# EAGLE design openSipPuff (rev B) (EAGLE 6.4)
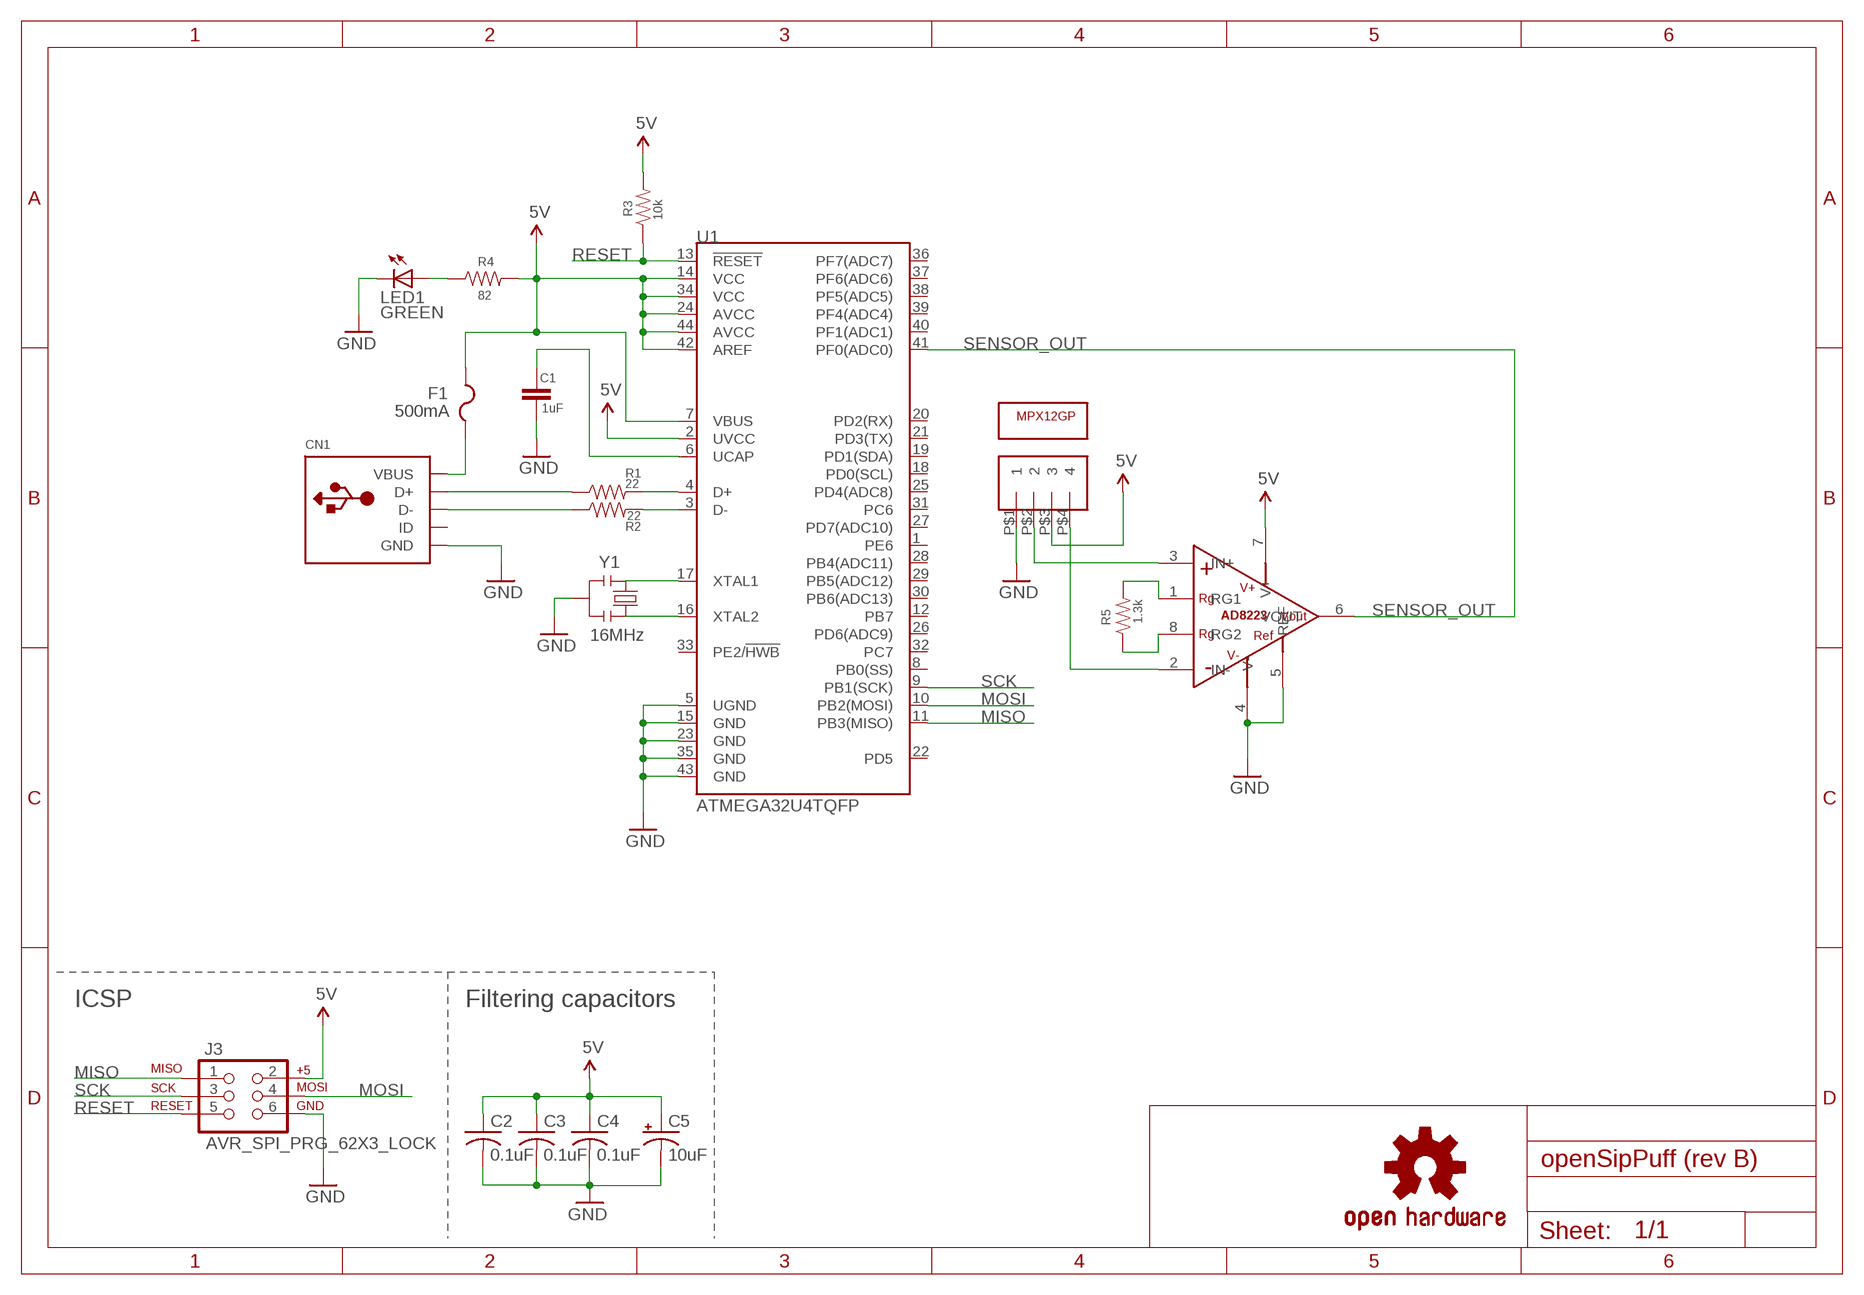
[diagram p0: schematic, sheet 1]

## Parts
C1  1uF  CAP0805  [0805]
C2  0.1uF  C-USC0805K  [C0805K]
C3  0.1uF  C-USC0805K  [C0805K]
C4  0.1uF  C-USC0805K  [C0805K]
C5  10uF  CPOL-USA/3216-18R  [A/3216-18R]
CN1  USBMOLEX  [USB-MINIB-THM-MOLEX]
F1  500mA  PTCFUSE-1206  [R1206]
J2  1X04-RA  [1X04-RA]
J3  AVR_SPI_PRG_62X3_LOCK  [2X3_LOCK]
LED1  GREEN  LEDCHIPLED_0805  [CHIPLED_0805]
LOGO1  OSHW-LOGOM  [OSHW-LOGO-M]
R1  22  RESISTOR0805-RES  [0805]
R2  22  RESISTOR0805-RES  [0805]
R3  10k  RESISTOR0805-RES  [0805]
R4  82  RESISTOR0805-RES  [0805]
R5  1.3k  RESISTOR0805-RES  [0805]
U1  ATMEGA32U4TQFP  [SPARKFUN-DIGITALIC_TQFP44]
U2  AD8223  [MSOP-8]
U3  MPX12GP  [MPX12GP]
Y1  16MHz  RESONATORPTH  [RESONATOR-PTH]

## Nets
5V: C2.1 C3.1 C4.1 C5.+ F1.2 J2.P$3 J3.2 R3.2 R4.2 U1.2(UVCC) U1.7(VBUS) U1.14(VCC) U1.24(AVCC) U1.34(VCC) U1.42(AREF) U1.44(AVCC) U2.7(V+)
D+: CN1.D+ R1.1
D-: CN1.D- R2.1
GND: C1.2 C2.2 C3.2 C4.2 C5.- CN1.GND J2.P$1 J3.6 LED1.C U1.5(UGND) U1.15(GND) U1.23(GND) U1.35(GND) U1.43(GND) U2.4(V-) U2.5(REF) Y1.2
MISO: J3.1 U1.11(PB3(MISO))
MOSI: J3.4 U1.10(PB2(MOSI))
N$1: R1.2 U1.4(D+)
N$2: R2.2 U1.3(D-)
N$3: C1.1 U1.6(UCAP)
N$4: CN1.VBUS F1.1
N$5: U1.17(XTAL1) Y1.1
N$6: U1.16(XTAL2) Y1.3
N$7: R5.2 U2.1(RG1)
N$10: J2.P$2 U2.3(IN+)
N$11: R5.1 U2.8(RG2)
N$12: LED1.A R4.1
N$13: J2.P$4 U2.2(IN-)
RESET: J3.5 R3.1 U1.13(!RESET)
SCK: J3.3 U1.9(PB1(SCK))
SENSOR_OUT: U1.41(PF0(ADC0)) U2.6(VOUT)
Unconnected: CN1.ID U1.1(PE6) U1.8(PB0(SS)) U1.12(PB7) U1.18(PD0(SCL)) U1.19(PD1(SDA)) U1.20(PD2(RX)) U1.21(PD3(TX)) U1.22(PD5) U1.25(PD4(ADC8)) U1.26(PD6(ADC9)) U1.27(PD7(ADC10)) U1.28(PB4(ADC11)) U1.29(PB5(ADC12)) U1.30(PB6(ADC13)) U1.31(PC6) U1.32(PC7) U1.33(PE2/!HWB) U1.36(PF7(ADC7)) U1.37(PF6(ADC6)) U1.38(PF5(ADC5)) U1.39(PF4(ADC4)) U1.40(PF1(ADC1))

## Notes on the sheet
- ICSP | Filtering capacitors

## Library data of the parts
C1 = SparkFun-Capacitors:CAP: Capacitor Standard 0603 ceramic capacitor, and 0.1" leaded capacitor.
C2-C4 = adafruit:C-US: CAPACITOR, American symbol
C5 = adafruit:CPOL-US: POLARIZED CAPACITOR, American symbol
CN1 = adafruit:USB: USB Connectors USBMINIB - Surface Mount Female Mini-B USB Connector 4UConnector: 06564 By microbuilder.eu Thru-hole RA Female Mini-B USB Connector 4UConnector: 18732 By ladyada.net
F1 = adafruit:PTCFUSE: PTC fuses, resettable thermistors
J2 = sip-and-puff:1X04-RA
J3 = SparkFun-Connectors:AVR_SPI_PRG_6: AVR ISP 6 Pin This is the reduced ISP connector for AVR programming. Common on Arduino. This footprint will take up less PCB space and can be used with a 10-pin to 6-pin adapter such as SKU: BOB-08508
LED1 = led:LED: LED OSRAM: - CHIPLED LG R971, LG N971, LY N971, LG Q971, LY Q971, LO R971, LY R971 LH N974, LH R974 LS Q976, LO Q976, LY Q976 LO Q996 - Hyper CHIPLED LW Q18S LB Q993, LB Q99A, LB R99A - SideLED LS A670, LO A670, LY A670, LG A670, LP A670 LB A673, LV A673, LT A673, LW A673 LH A674 LY A675 LS A676, LA A676, LO A676, LY A676, LW A676 LS A679, LY A679, LG A679 - Hyper Micro SIDELED® LS Y876, LA Y876, LO Y876, LY Y876 LT Y87S - SmartLED LW L88C, LW L88S LB L89C, LB L89S, LG L890 LS L89K, LO L89K, LY L89K LS L896, LA L896, LO L896, LY L896 - TOPLED LS T670, LO T670, LY T670, LG T670, LP T670 LSG T670, LSP T670, LSY T670, LOP T670, LYG T670 LG T671, LOG T671, LSG T671 LB T673, LV T673, LT T673, LW T673 LH T674 LS T676, LA T676, LO T676, LY T676, LB T676, LH T676, LSB T676, LW T676 LB T67C, LV T67C, LT T67C, LS T67K, LO T67K, LY T67K, LW E67C LS E67B, LA E67B, LO E67B, LY E67B, LB E67C, LV E67C, LT E67C LW T67C LS T679, LY T679, LG T679 LS T770, LO T770, LY T770, LG T770, LP T770 LB T773, LV T773, LT T773, LW T773 LH T774 LS E675, LA E675, LY E675, LS T675 LS T776, LA T776, LO T776, LY T776, LB T776 LHGB T686 LT T68C, LB T68C - Hyper Mini TOPLED® LB M676 - Mini TOPLED Santana® LG M470 LS M47K, LO M47K, LY M47K Source: http://www.osram.convergy.de LUXEON: - LUMILED® LXK2-PW12-R00, LXK2-PW12-S00, LXK2-PW14-U00, LXK2-PW14-V00 LXK2-PM12-R00, LXK2-PM12-S00, LXK2-PM14-U00 LXK2-PE12-Q00, LXK2-PE12-R00, LXK2-PE12-S00, LXK2-PE14-T00, LXK2-PE14-U00 LXK2-PB12-K00, LXK2-PB12-L00, LXK2-PB12-M00, LXK2-PB14-N00, LXK2-PB14-P00, LXK2-PB14-Q00 LXK2-PR12-L00, LXK2-PR12-M00, LXK2-PR14-Q00, LXK2-PR14-R00 LXK2-PD12-Q00, LXK2-PD12-R00, LXK2-PD12-S00 LXK2-PH12-R00, LXK2-PH12-S00 LXK2-PL12-P00, LXK2-PL12-Q00, LXK2-PL12-R00 Source: www.luxeon.com KINGBRIGHT: KA-3528ASYC Source: www.kingbright.com
LOGO1 = SparkFun-Aesthetics:OSHW-LOGO: Open Source Hardware Logo This logo indicates the piece of hardware it is found on incorporates a OSHW license and/or adheres to the definition of open source hardware found here: http://freedomdefined.org/OSHW
R1-R5 = SparkFun-Resistors:RESISTOR: Resistor Basic schematic elements and footprints for 0603, 1206, and PTH resistors.
U1 = SparkFun-DigitalIC:ATMEGA32U4: Atmel 44-pin 8-bit Microcontroller with 32KBytes of ISP Flash and USB Controller
U2 = sip-and-puff:AD8223
U3 = sip-and-puff:MPX12GP
Y1 = SparkFun-FreqCtrl:RESONATOR: Resonator Small SMD resonator. Used, eg, on the Arduino Pro/ Pro Mini boards. 8MHz- XTAL-08895 16MHz- XTAL-08900

## Board
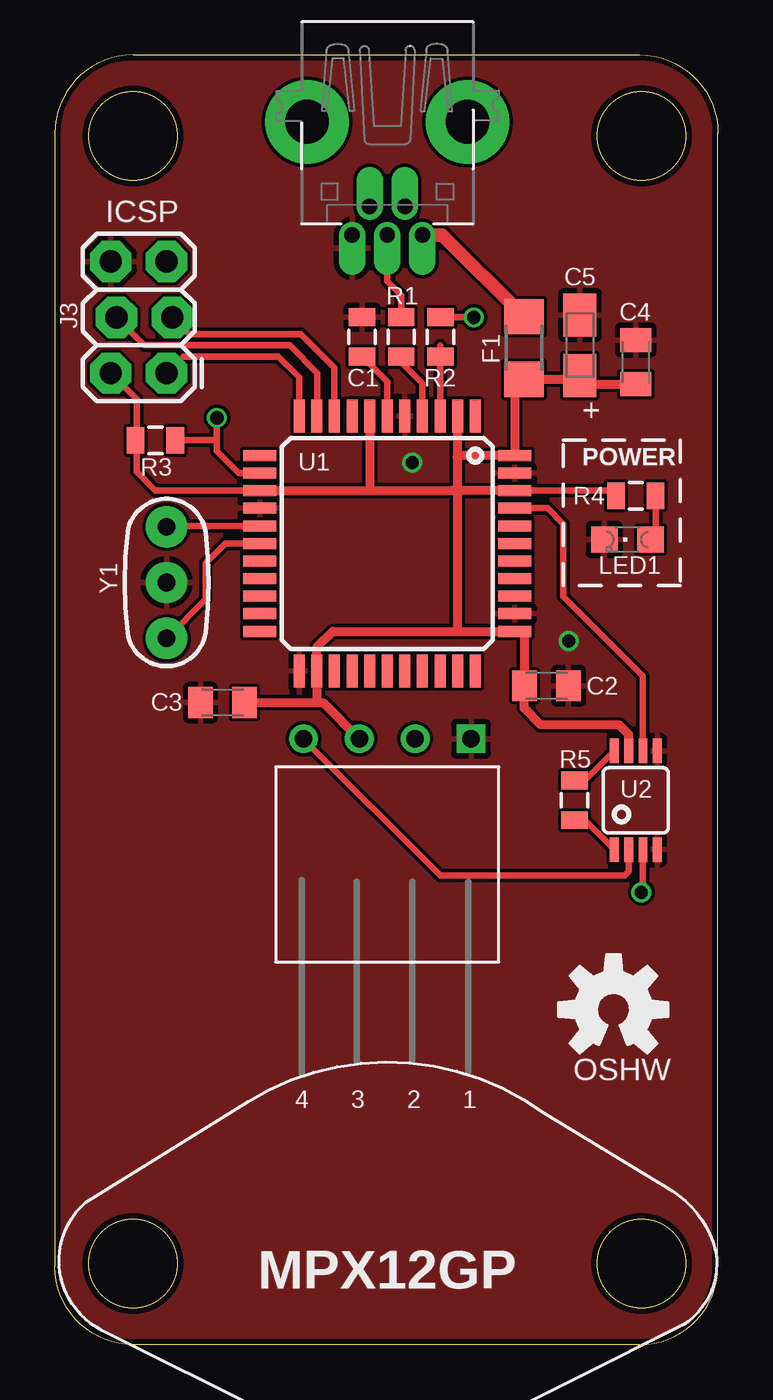
[diagram p1: board, top side]
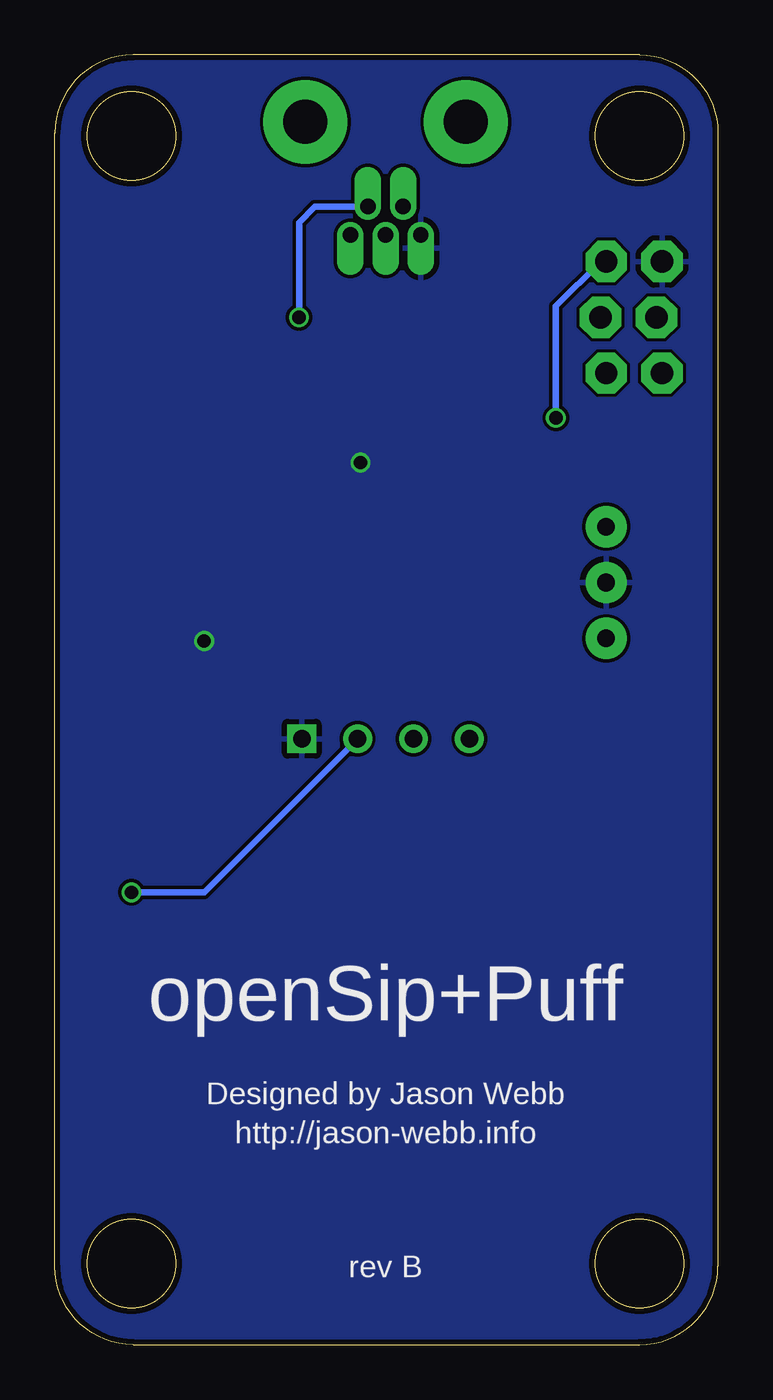
[diagram p2: board, bottom side, seen from below]

Size 30.15 x 58.67 mm. Coordinates in mm from the lower left corner, seen from the top.
Outline: 30.15,3.56 30.15,55.12 arc90 26.59,58.67 3.56,58.67 arc90 0,55.12 0,3.56 arc90 3.56,0 26.59,0 arc90 30.15,3.56
Outline: circle at 3.56,54.99 radius 2.02
Outline: circle at 26.67,54.99 radius 2.02
Copper layers (1*16): Top 0.035mm / dielectric 1.5mm / Bottom 0.035mm
Design rules "Fusion_eagle_rule_v1.1": minimum track width 6mil, minimum drill 12mil, track to track 6mil, track to pad 6mil, pad to pad 6mil, via to via 6mil, smd to smd 0mil, copper to edge 10mil, drill to drill 10mil, minimum pad ring 10mil, minimum via ring 6mil, stop-mask expansion 2mil, vias tented up to drill 100mil, thermal gap 10mil

### Footprints (pad centres in the part's own frame; a part is rotated, then mirrored left to right if it is on the bottom)
0805 = smd 0.8 x 1.2: 1 -0.9,0; 2 0.9,0
C0805K = smd 1.1 x 1.4: 1 -1,0; 2 1,0
A/3216-18R = smd 1.95 x 1.5: + 1.375,0; - -1.375,0
USB-MINIB-THM-MOLEX = drill 0.7 offset: D+ 0,9.72; D- -0.8,8.42; GND 1.6,9.72; ID 0.8,8.42; VBUS -1.6,9.72 | drill 2 pad 3.81: GND1 -3.65,4.57; GND4 3.65,4.57
R1206 = smd 1.6 x 1.803: 1 -1.422,0; 2 1.422,0
1X04-RA = drill 0.8 square: P$1 -3.81,-5.08 | drill 0.8: P$2 -1.27,-5.08; P$3 1.27,-5.08; P$4 3.81,-5.08
2X3_LOCK = drill 1.016 pad 1.88 octagon: 1 0,0; 2 0,2.54; 3 2.54,-0.254; 4 2.54,2.286; 5 5.08,0; 6 5.08,2.54
CHIPLED_0805 = smd 1.2 x 1.2: A 0,-1.05; C 0,1.05
SPARKFUN-DIGITALIC_TQFP44 = smd 1.5 x 0.5: 1 -5.8,4; 2 -5.8,3.2; 3 -5.8,2.4; 4 -5.8,1.6; 5 -5.8,0.8; 6 -5.8,0; 7 -5.8,-0.8; 8 -5.8,-1.6; 9 -5.8,-2.4; 10 -5.8,-3.2; 11 -5.8,-4; 23 5.8,-4; 24 5.8,-3.2; 25 5.8,-2.4; 26 5.8,-1.6; 27 5.8,-0.8; 28 5.8,0; 29 5.8,0.8; 30 5.8,1.6; 31 5.8,2.4; 32 5.8,3.2; 33 5.8,4 | smd 0.5 x 1.5: 12 -4,-5.8; 13 -3.2,-5.8; 14 -2.4,-5.8; 15 -1.6,-5.8; 16 -0.8,-5.8; 17 0,-5.8; 18 0.8,-5.8; 19 1.6,-5.8; 20 2.4,-5.8; 21 3.2,-5.8; 22 4,-5.8; 34 4,5.8; 35 3.2,5.8; 36 2.4,5.8; 37 1.6,5.8; 38 0.8,5.8; 39 0,5.8; 40 -0.8,5.8; 41 -1.6,5.8; 42 -2.4,5.8; 43 -3.2,5.8; 44 -4,5.8
MSOP-8 = smd 0.4 x 1.1: 1 -0.975,-2.25; 2 -0.325,-2.25; 3 0.325,-2.25; 4 0.975,-2.25; 5 0.975,2.25; 6 0.325,2.25; 7 -0.325,2.25; 8 -0.975,2.25
RESONATOR-PTH = drill 0.8 pad 1.88: 1 -2.54,0; 2 0,0; 3 2.54,0

### Placement (x,y rotation side)
C1  13.97,45.85 90 top
C2  22.35,29.97 0 top
C3  7.62,29.21 180 top
C4  26.42,44.7 90 top
C5  23.88,45.47 270 top
CN1  15.11,60.2 180 top
F1  21.34,45.34 270 top
J2  15.11,22.48 180 top
J3  5.08,44.2 90 top
LED1  26.04,36.63 90 top
LOGO1  25.4,15.24 0 top
R1  15.75,45.85 270 top
R2  17.53,45.85 270 top
R3  4.57,41.15 180 top
R4  26.42,38.61 180 top
R5  23.62,24.77 270 top
U1  15.11,36.45 270 top
U2  26.42,24.77 0 top
U3  15.11,3.68 180 top
Y1  5.08,34.67 90 top

### Tracks (layer width: path | path; a pad name or v marks a point on that pad's centre or on a via)
5V
  Top 0.305: J3.2 3.72,43.01 3.72,41.2 R3.2 3.72,41.1 3.72,39.71 4.57,38.86 9.3,38.86 U1.14 | U1.42 25.27,38.85 R4.2
  Top 0.406: U1.2 18.29,42.25 18.29,40.39 | 18.29,40.39 18.29,38.86 | 18.29,38.86 18.29,32.45 | 18.29,32.45 U1.34 21.35,32.45 C2.1 21.34,29.96 21.34,28.96 22.1,28.19 25.65,28.19 26.09,27.76 U2.7 | 18.29,32.45 12.64,32.45 11.91,31.73 U1.24 11.91,29.23 11.94,29.21 | U1.14 9.31,38.86 14.31,38.86 | 14.31,38.86 18.03,38.86 | 18.03,38.86 18.29,38.86 | U1.7 14.31,38.86 | U1.42 18.05,38.85 18.03,38.86 | 18.29,40.39 18.35,40.45 U1.44 20.91,43.49 F1.2 23.7,43.92 C5.+ 24.26,43.7 C4.1 | C3.1 11.94,29.21 | 11.94,29.21 12.19,29.21 J2.P$3
D+
  Top 0.305: CN1.D+ 15.11,48.39 15.75,47.75 R1.1
D-  (via drill 0.6)
  Top 0.305: R2.1 v19.04,46.75 v19.05,46.74
  Bottom 0.305: CN1.D- 18.33,51.78 19.05,51.05 v19.05,46.74
GND  (via drill 0.6)
  other vias: 23.37,32 16.26,40.13
  pour Bottom: -0.25,-0.25 30.48,-0.25 30.48,58.8 -0.25,58.8
  pour Top: -0.25,-0.25 30.48,-0.25 30.48,58.8 -0.25,58.8
MISO
  Top 0.305: J3.1 5.84,44.96 10.16,44.96 11.11,44.01 U1.11
MOSI
  Top 0.305: J3.4 4.06,45.47 10.67,45.47 11.94,44.2 11.94,42.27 U1.10
N$1
  Top 0.305: R1.2 15.75,44.7 16.71,43.74 U1.4
N$2
  Top 0.305: R2.2 17.51,45.44 U1.3
N$3
  Top 0.305: C1.1 14.22,45.2 14.22,44.7 15.11,43.81 U1.6
N$4
  Top 0.61: CN1.VBUS 17.62,50.48 F1.1
N$5
  Top 0.305: U1.17 7.75,36.45 6.86,35.56 6.86,33.91 Y1.1
N$6
  Top 0.305: Y1.3 5.12,37.25 U1.16
N$7
  Top 0.305: R5.2 24.09,23.86 U2.1
N$10  (via drill 0.6)
  Top 0.305: v26.67,20.57 26.74,20.64 U2.3
  Bottom 0.305: J2.P$2 23.37,20.57 v26.67,20.57
N$11
  Top 0.305: R5.1 24.09,25.66 U2.8
N$12
  Top 0.305: R4.1 27.32,36.86 LED1.A
N$13
  Top 0.305: J2.P$4 17.53,21.34 25.91,21.34 26.09,21.52 U2.2
RESET  (via drill 0.6)
  Top 0.305: U1.13 8.36,39.65 7.37,40.64 7.37,41.15 | 7.37,41.15 v7.37,42.16 | R3.1 7.37,41.15
  Bottom 0.305: J3.5 5.33,49.28 7.37,47.24 v7.37,42.16
SCK
  Top 0.305: J3.3 6.1,45.97 11.18,45.97 12.71,44.44 U1.9
SENSOR_OUT
  Top 0.305: U1.41 22.4,38.05 23.11,37.34 23.11,34.04 26.74,30.41 U2.6

### Text on the board
tPlace: ICSP | POWER | Y1 | OSHW
bPlace: openSip+Puff | Designed by Jason Webb | http://jason-webb.info | rev B
tDocu: RST | SCK | MISO